# Altium schematic sheet Miscellaneous.SchDoc: RK3399 SOM Module
size A4; Date: 23.05.2023; Author: Łukasz Nowarkiewicz; SheetNumber: 19; SheetTotal: 21; RegistrationBookNumber: 144201; title_sheet: Miscellaneous
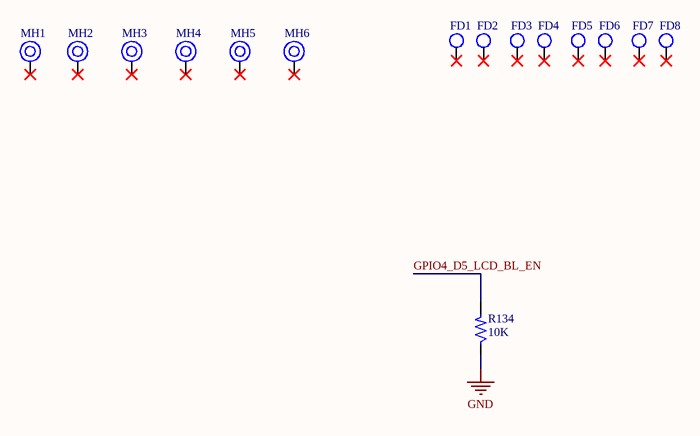
[diagram p0: Miscellaneous.SchDoc]

## Parts
FD1  Fiducial  [FIDUCIAL_50MIL]  (value not drawn)
FD2  Fiducial  [FIDUCIAL_50MIL]  (value not drawn)
FD3  Fiducial  [FIDUCIAL_50MIL]  (value not drawn)
FD4  Fiducial  [FIDUCIAL_50MIL]  (value not drawn)
FD5  Fiducial  [FIDUCIAL_50MIL]  (value not drawn)
FD6  Fiducial  [FIDUCIAL_50MIL]  (value not drawn)
FD7  Fiducial  [FIDUCIAL_50MIL]  (value not drawn)
FD8  Fiducial  [FIDUCIAL_50MIL]  (value not drawn)
MH1  Mounting Hole  [SOM_Mounting]  (value not drawn)  (no BOM)
MH2  Mounting Hole  [SOM_Mounting]  (value not drawn)  (no BOM)
MH3  Mounting Hole  [SOM_Mounting]  (value not drawn)  (no BOM)
MH4  Mounting Hole  [SOM_Mounting]  (value not drawn)  (no BOM)
MH5  Mounting Hole  [SOM_Mounting]  (value not drawn)  (no BOM)
MH6  Mounting Hole  [SOM_Mounting]  (value not drawn)  (no BOM)
R134  10K  [RES_0402]

## Nets
GND: R134.1
GPIO4_D5_LCD_BL_EN: R134.2

Not connected (* = marked no-connect by the designer): FD1 1*; FD2 1*; FD3 1*; FD4 1*; FD5 1*; FD6 1*; FD7 1*; FD8 1*; MH1 1*; MH2 1*; MH3 1*; MH4 1*; MH5 1*; MH6 1*

## Notes on the sheet
- Nazwa arkusza
- Nazwa projektu
- Imie i nazwisko
- Data wykonania
- Numer indeksu

## Library data of the parts
FD1-FD8 = Fiducials_78.7mil: 78.7mil Fiducials SMD; Manufacturer: NA; Nymble Part Number: 1EA-AA-0523; Manufacturer Part Number: NA; Case/Package: SMD; Supplier-1: NA; Supplier Part Number-1: NA; Alternate Part Number-1: NA; Category: Fiducial; Number of Pins: 1
MH1-MH6 = MH_3.5H_6D: Manufacturer Part Number: NA; Case/Package: TH; Manufacturer: NA; Supplier-1: NA
R134 = RES_10K-0.1W-1%-0402: 10 kOhms ±1% 0.1W, 1/10W Chip Resistor 0402 (1005 Metric) Anti-Sulfur Thin Film; Manufacturer: Vishay Beyschlag/Draloric/BC Components; Manufacturer Part Number: MCS04020C1002FE000; Case/Package: 0402; Supplier-1: Digikey